# EAGLE design GBZLNDShield (EAGLE 9.1.0)
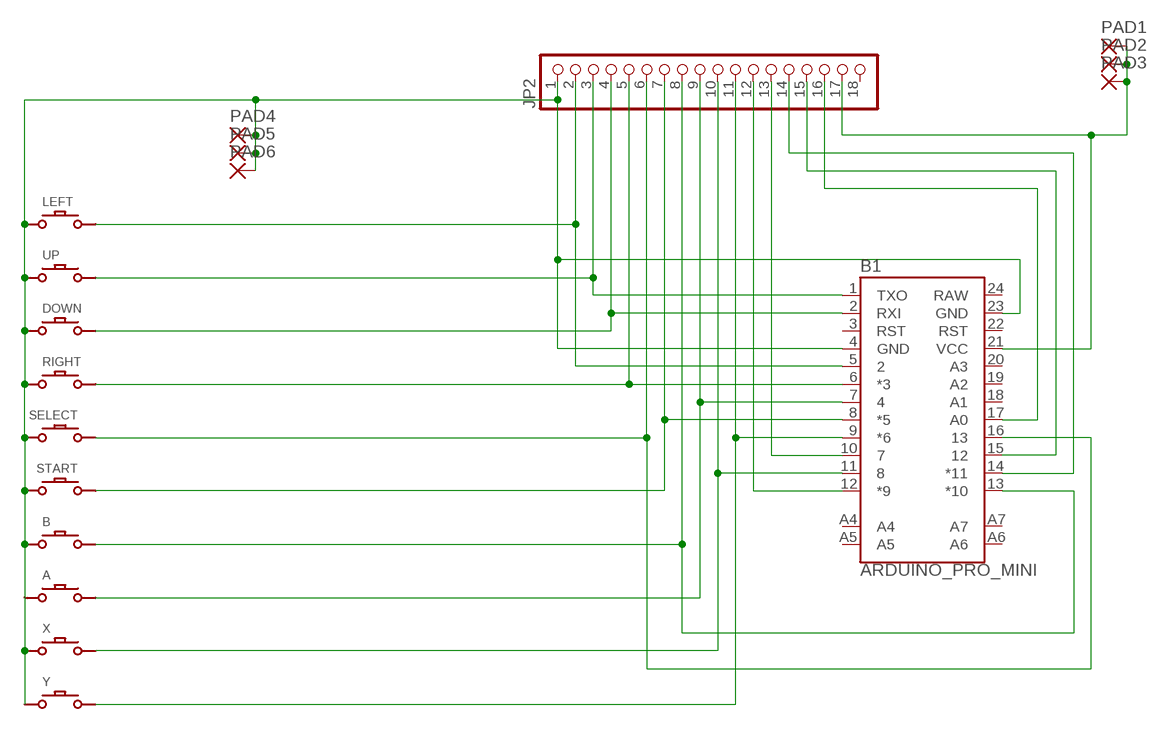
[diagram p0: schematic, sheet 1]

## Parts
A  DMG-BTN  DMG-BTNREGULAR  [DMG-BTN]
B  DMG-BTN  DMG-BTNREGULAR  [DMG-BTN]
B1  ARDUINO_PRO_MINI  [ARDUINO_PRO_MINI]
DOWN  DMG-BTN  DMG-BTNREGULAR  [DMG-BTN]
JP2  PINHD-1X18-BIG  [1X18-BIG]
LEFT  DMG-BTN  DMG-BTNREGULAR  [DMG-BTN]
PAD1  SMD5  [SMD2,54-5,08]
PAD2  SMD5  [SMD2,54-5,08]
PAD3  SMD5  [SMD2,54-5,08]
PAD4  SMD5  [SMD2,54-5,08]
PAD5  SMD5  [SMD2,54-5,08]
PAD6  SMD5  [SMD2,54-5,08]
RIGHT  DMG-BTN  DMG-BTNREGULAR  [DMG-BTN]
SELECT  DMG-BTN  DMG-BTNSELECT  [DMG-SEL]
START  DMG-BTN  DMG-BTNSELECT  [DMG-SEL]
UP  DMG-BTN  DMG-BTNREGULAR  [DMG-BTN]
X  DMG-BTN  DMG-BTNREGULAR  [DMG-BTN]
Y  DMG-BTN  DMG-BTNREGULAR  [DMG-BTN]

## Nets
GND: A.P$1 B1.4(GND) B1.23(GND) B.P$1 DOWN.P$1 JP2.1 LEFT.P$1 PAD4.1(P) PAD5.1(P) PAD6.1(P) RIGHT.P$1 SELECT.P$2 START.P$2 UP.P$1 X.P$1 Y.P$1
N$1: B1.5 JP2.2 LEFT.P$2
N$2: B1.1(TXO) JP2.3 UP.P$2
N$3: B1.2(RXI) DOWN.P$2 JP2.4
N$4: B1.6(*3) JP2.5 RIGHT.P$2
N$5: B1.16 JP2.6 SELECT.P$1
N$6: B1.12(*9) JP2.12
N$7: B1.13(*10) B.P$2 JP2.8
N$8: A.P$2 B1.7 JP2.9
N$9: B1.10 JP2.13
N$10: B1.14(*11) JP2.14
N$11: B1.8(*5) JP2.7 START.P$1
N$12: B1.9(*6) JP2.11 Y.P$2
N$13: B1.11 JP2.10 X.P$2
N$14: B1.15 JP2.15
N$15: B1.17(A0) JP2.16
N$17: B1.21(VCC) JP2.17 PAD1.1(P) PAD2.1(P) PAD3.1(P)
Unconnected: B1.3(RST) B1.18(A1) B1.19(A2) B1.20(A3) B1.22(RST) B1.A4 B1.A5 B1.A6 B1.A7 JP2.18

## Power pins joined to a net without a drawn wire
RAW: B1.24(RAW)

## Library data of the parts
A B DOWN LEFT RIGHT SELECT START UP X Y = Game Boy:DMG-BTN
B1 = SparkFun-Boards:ARDUINO_PRO_MINI: SparkFun Pro Mini Pro Mini compatible footprint. Dimensions: 0.7 x 1.3" PCB Thickness: 0.8mm SparkFun Products: 3.3V/8MHz <https://www.sparkfun.com/products/11114> 5V/16MHz <https://www.sparkfun.com/products/11113>
JP2 = adafruit:PINHD-1X18: PIN HEADER
PAD1-PAD6 = wirepad:SMD5: SMD PAD

## Board
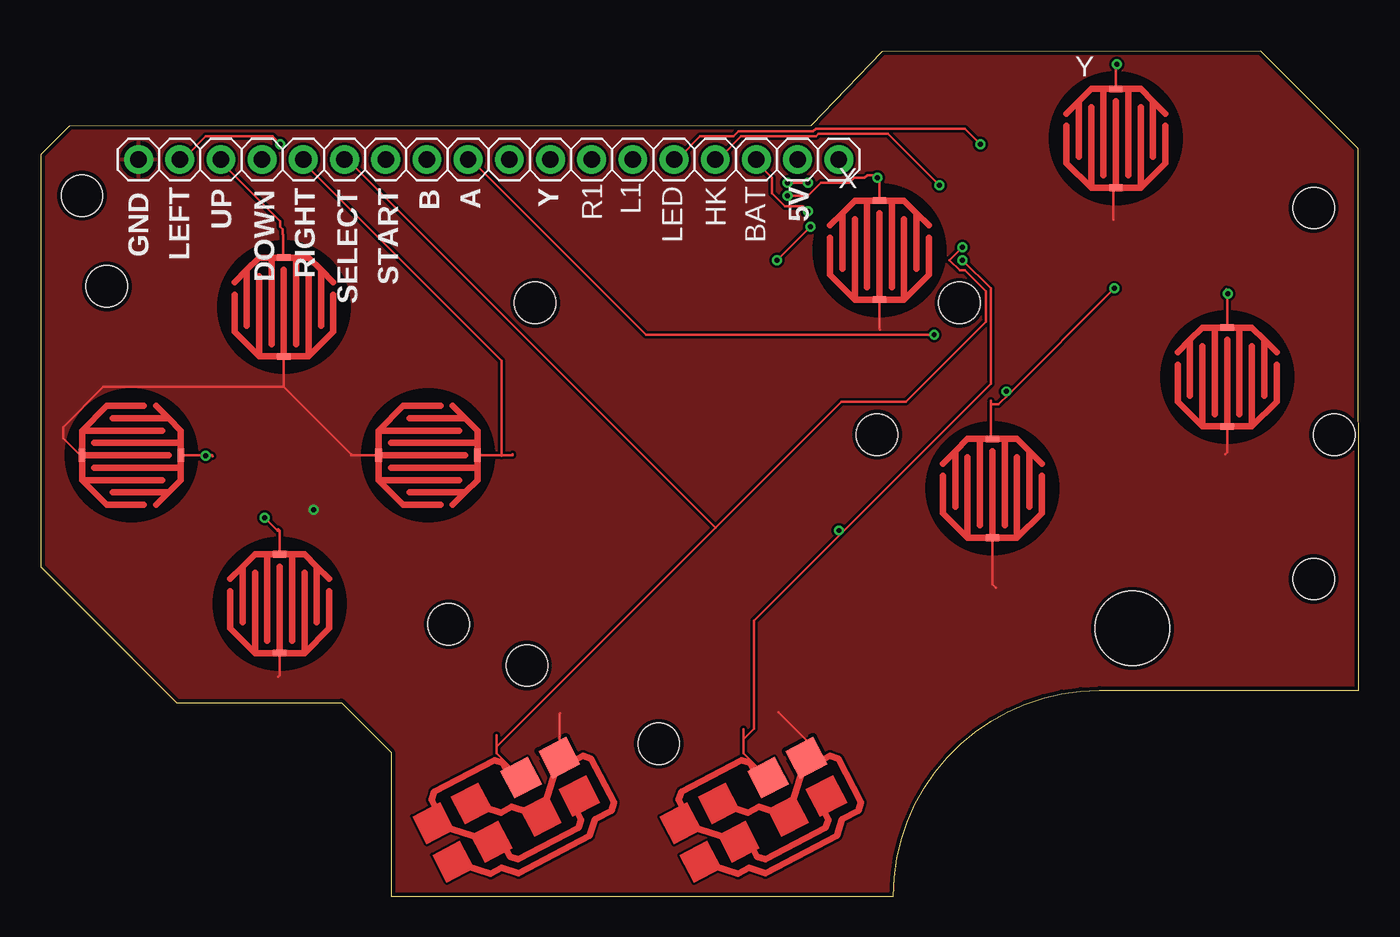
[diagram p1: board, top side]
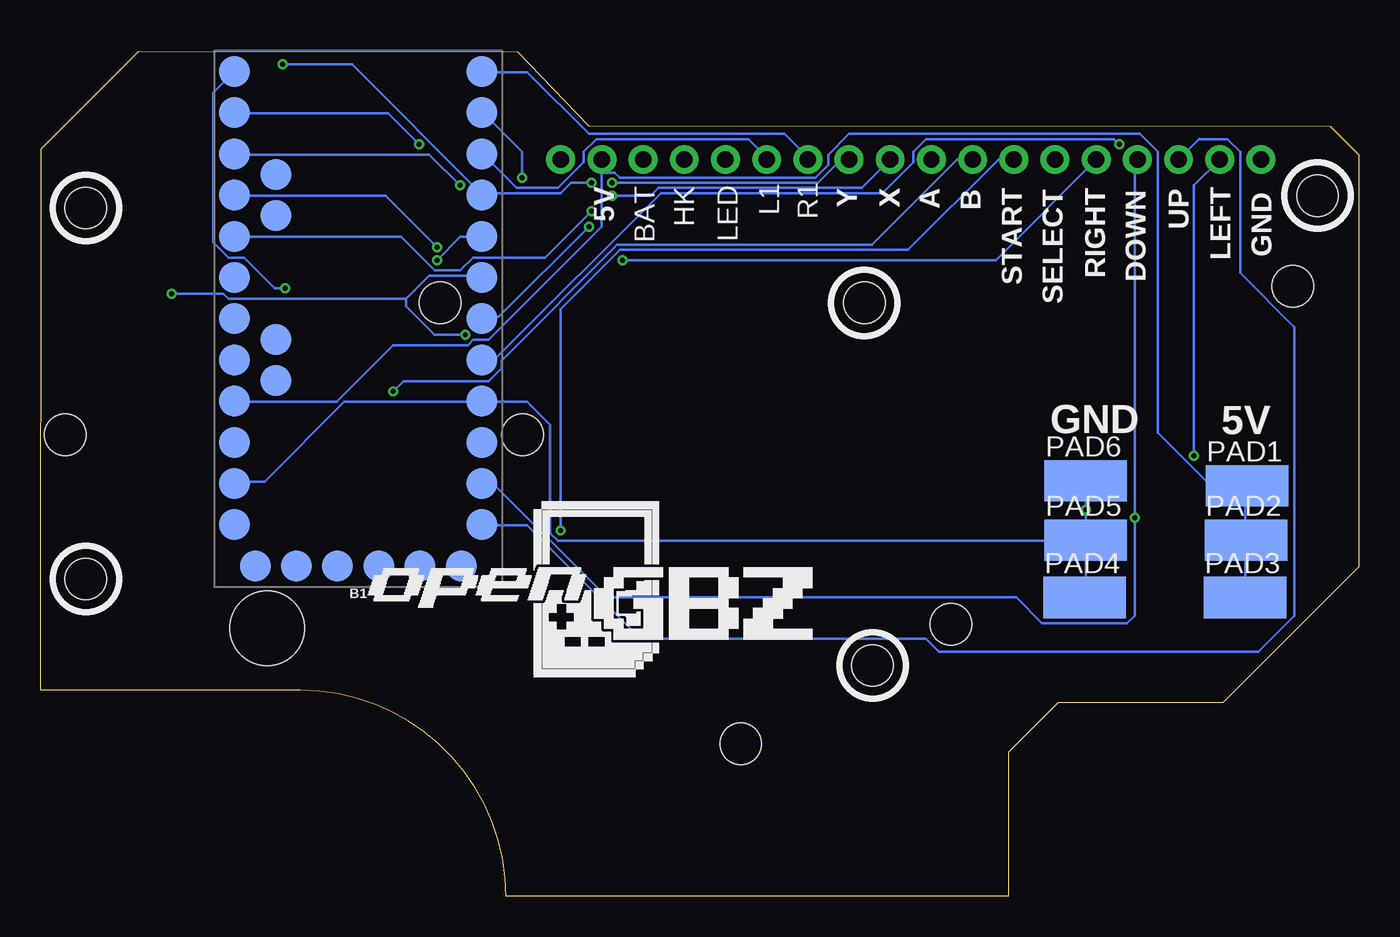
[diagram p2: board, bottom side, seen from below]

Size 81.3 x 52.08 mm. Coordinates in mm from the lower left corner, seen from the top.
Outline: 75.24,52.08 51.89,52.07 47.52,47.5 1.78,47.48 0,45.7 0.02,20.32 8.4,11.94 18.56,11.94 21.61,8.89 21.61,0 52.6,0 arc-90 65.3,12.7 81.3,12.7 81.26,45.73 81.26,45.75 81.26,46.01 81.26,46.01 81.26,46.06 81.25,46.08 81.25,46.08 75.24,52.08
Copper layers (1*16): Top 0.035mm / dielectric 1.5mm / Bottom 0.035mm
Design rules "ITEADstudio_DRC": minimum track width 6mil, minimum drill 12mil, track to track 6mil, track to pad 6mil, pad to pad 6mil, via to via 6mil, smd to smd 0mil, copper to edge 10mil, drill to drill 10mil, minimum pad ring 10mil, minimum via ring 6mil, stop-mask expansion 2mil, vias tented up to drill 100mil, thermal gap 10mil
Holes 4.57 mm at 67.33,16.51
Holes 2.54 mm at 2.56,43.18 78.5,42.42 78.5,19.56 30.5,36.58 56.66,36.58 29.99,14.22 51.58,28.45 25.16,16.76 38.12,9.4 79.77,28.45 4.08,37.59

### Footprints (pad centres in the part's own frame; a part is rotated, then mirrored left to right if it is on the bottom)
DMG-BTN = smd 0.813 x 0.406: P$1 0,-3.048; P$2 0,3.048
ARDUINO_PRO_MINI = smd 1.905 x 1.905: 1 -7.62,12.7; 2 -7.62,10.16; 3 -7.62,7.62; 4 -7.62,5.08; 5 -7.62,2.54; 6 -7.62,0; 7 -7.62,-2.54; 8 -7.62,-5.08; 9 -7.62,-7.62; 10 -7.62,-10.16; 11 -7.62,-12.7; 12 -7.62,-15.24; 13 7.62,-15.24; 14 7.62,-12.7; 15 7.62,-10.16; 16 7.62,-7.62; 17 7.62,-5.08; 18 7.62,-2.54; 19 7.62,0; 20 7.62,2.54; 21 7.62,5.08; 22 7.62,7.62; 23 7.62,10.16; 24 7.62,12.7; A4 5.08,1.27; A5 5.08,3.81; A6 5.08,-8.89; A7 5.08,-6.35; BLK -6.35,15.24; GND -3.81,15.24; GRN 6.35,15.24; RXI 1.27,15.24; TX0 3.81,15.24; VCC -1.27,15.24
1X18-BIG = drill 1.016 pad 1.778: 1 -21.59,0; 2 -19.05,0; 3 -16.51,0; 4 -13.97,0; 5 -11.43,0; 6 -8.89,0; 7 -6.35,0; 8 -3.81,0; 9 -1.27,0; 10 1.27,0; 11 3.81,0; 12 6.35,0; 13 8.89,0; 14 11.43,0; 15 13.97,0; 16 16.51,0; 17 19.05,0; 18 21.59,0
SMD2,54-5,08 = smd 2.54 x 5.08: 1 0,0
DMG-SEL = smd 1.905 x 1.905: P$1 1.714,1.333; P$2 4.381,1.333

### Placement (x,y rotation side)
A  73.17,32 0 top
B  58.69,25.15 0 top
B1  61.71,35.6 180 bottom
DOWN  14.75,18.03 0 top
JP2  27.63,45.42 0 top
LEFT  5.61,27.18 270 top
PAD1  6.91,25.3 270 bottom
PAD2  6.97,21.95 270 bottom
PAD3  7.03,18.41 270 bottom
PAD4  16.9,18.41 270 bottom
PAD5  16.84,21.95 270 bottom
PAD6  16.84,25.6 270 bottom
RIGHT  23.89,27.18 270 top
SELECT  28.72,5.33 27.5 top
START  43.96,5.33 27.5 top
UP  15,36.32 0 top
X  51.73,39.83 0 top
Y  66.31,46.72 0 top

### Tracks (layer width: path | path; a pad name or v marks a point on that pad's centre or on a via)
GND  (via drill 0.3)
  Top 0.152: RIGHT.P$1 19.22,27.18 | 19.22,27.18 19.16,27.18 19.16,27.25 | UP.P$1 15,31.39 | 15,31.39 19.22,27.18 | 15,31.39 3.88,31.39 1.4,28.92 1.4,28.22 2.45,27.18 LEFT.P$1 | DOWN.P$1 14.75,13.63 14.65,13.53 | SELECT.P$2 31.99,11.25 32.02,11.28 | START.P$2 47.23,9.6 45.49,11.34 | B.P$1 58.69,19.23 58.91,19.02 | A.P$1 73.17,27.37 73.05,27.25 | X.P$1 51.73,34.98 51.77,34.93 | Y.P$1 66.16,43.52 66.16,41.7
  Bottom 0.152: PAD6.1 16.85,25.56 v16.85,23.81 16.85,22.07 PAD5.1 16.85,21.91 | 16.85,21.91 16.85,18.41 PAD4.1 | B1.23 69.23,25.56 67.49,25.56 62.57,30.48 54.15,30.48 B1.4 53.99,30.48 51.29,30.48 49.87,29.05 49.87,22.38 49.39,21.91 16.85,21.91
  pour Top (rank 6): 0.04,45.75 1.78,47.48 1.8,47.48 47.35,47.48 51.91,52.04 75.32,52.04 75.5,51.86 81.27,46.09 81.27,45.56 81.27,12.75 81.22,12.69 65.05,12.69 65.05,12.69 arc90 52.55,0.2 52.55,0.03 21.6,0.03 21.6,0.03 21.6,8.84 18.5,11.94 8.35,11.94 0.04,20.25
N$1  (via drill 0.3)
  Top 0.152: LEFT.P$2 10.18,27.18 | 10.18,27.18 10.57,27.18 10.63,27.13 | v10.18,27.15 10.18,27.18 | v14.78,46.35 14.31,46.83 10.18,46.83 8.91,45.56 8.59,45.56 JP2.2
  Bottom 0.152: v10.18,27.15 10.18,43.81 8.59,45.4 JP2.2 | v14.78,46.35 15.1,46.67 26.69,46.67 27.48,45.88 27.48,45.24 29.39,43.34 43.04,43.34 53.2,33.18 53.99,33.18 B1.5
N$2
  Top 0.152: UP.P$2 14.95,39.42 14.95,40.78 14.94,40.8 14.94,41.12 14.78,41.27 14.78,41.59 10.97,45.4 JP2.3
  Bottom 0.152: B1.1 53.99,22.86 51.29,22.86 44.31,15.88 26.69,15.88 25.89,15.08 6.21,15.08 3.99,17.3 3.99,35.08 7.32,38.42 7.32,45.88 8.11,46.67 9.86,46.67 10.97,45.56 JP2.3
N$3  (via drill 0.3)
  Top 0.152: DOWN.P$2 14.75,22.52 14.67,22.59 | 14.67,22.59 14.65,22.62 | v13.83,23.34 14.62,22.54 14.67,22.59
  Bottom 0.152: JP2.4 13.67,45.4 13.83,45.24 v13.83,23.34 13.83,17.3 14.31,16.83 19.54,16.83 21.13,18.41 46.37,18.41 53.36,25.4 53.99,25.4 B1.2
N$4  (via drill 0.3)
  Top 0.152: RIGHT.P$2 28.43,27.18 | 28.43,27.18 29.1,27.18 29.1,27.25 | 28.43,27.18 28.43,33.02 16.05,45.4 JP2.5 | 28.43,27.15 28.43,27.18 | v45.42,39.21 v47.48,41.27
  Bottom 0.152: v47.48,41.27 53.04,35.72 53.99,35.72 B1.6 | v45.42,39.21 22.4,39.21 16.21,45.4 JP2.5
N$5  (via drill 0.3)
  Top 0.152: SELECT.P$1 28.12,8.81 28.12,9.21 | 28.12,9.21 28.12,9.94 | v56.85,40.01 56.06,39.21 56.69,38.58 57.01,38.58 58.28,37.31 58.28,35.4 53.36,30.48 49.39,30.48 41.61,22.7 | 41.61,22.7 28.12,9.21 | 41.61,22.7 19.39,44.93 19.23,44.93 18.75,45.4 JP2.6
  Bottom 0.152: v56.85,40.01 60.03,43.18 69.23,43.18 B1.16
N$6
  Bottom 0.152: B1.12 53.99,50.8 51.29,50.8 47.48,46.99 35.42,46.99 33.99,45.56 JP2.12
N$7  (via drill 0.3)
  Top 0.152: B.P$2 58.6,28.29 58.6,30.32 | 58.6,30.32 58.6,30.54 | 58.6,30.32 59.07,30.32 59.71,30.96 | v66.22,37.47 59.71,30.96 | 58.6,30.32 | 59.71,30.96 v59.55,31.11
  Bottom 0.152: v66.22,37.47 66.85,37.47 68.76,39.37 69.71,39.37 70.66,40.32 70.66,49.53 69.39,50.8 B1.13 | v59.55,31.11 58.91,31.75 53.68,31.75 52.88,32.54 52.88,33.02 45.74,40.16 30.02,40.16 24.78,45.4 23.83,45.4 JP2.8
N$8  (via drill 0.3)
  Top 0.152: A.P$2 73.17,37.15 | 73.17,37.15 73.17,37.37 73.11,37.43 | v73.2,37.15 73.17,37.15 | v55.1,34.61 37.32,34.61 27.01,44.93 26.85,44.93 26.37,45.4 JP2.9
  Bottom 0.152: v73.2,37.15 70.03,37.15 69.71,36.83 58.76,36.83 | 58.76,36.83 57.33,38.26 54.15,38.26 B1.7 | v55.1,34.61 57.01,34.61 58.76,36.35 58.76,36.83
N$9
  Bottom 0.152: B1.10 53.99,45.72 51.93,43.66 49.39,43.66 47.8,45.24 47.8,45.88 47.01,46.67 37.64,46.67 36.53,45.56 JP2.13
N$10  (via drill 0.3)
  Top 0.152: v57.96,46.35 57.01,47.31 47.8,47.31 47.64,47.15 43.04,47.15 42.72,46.83 40.66,46.83 39.39,45.56 39.07,45.56 JP2.14
  Bottom 0.152: v57.96,46.35 59.87,48.26 69.23,48.26 B1.14
N$11  (via drill 0.3)
  Top 0.152: START.P$1 43.36,8.81 43.36,9.68 | 43.36,9.68 43.36,10.3 | v56.85,39.21 58.6,37.47 58.6,31.59 49.39,22.38 | 49.39,22.38 43.99,16.99 43.99,10.32 43.36,9.68 | 49.39,22.38 v49.23,22.54
  Bottom 0.152: v56.85,39.21 55.42,40.64 54.15,40.64 B1.8 | v49.23,22.54 49.23,36.2 45.58,39.85 27.8,39.85 22.24,45.4 21.29,45.4 JP2.7
N$12  (via drill 0.3)
  Top 0.152: Y.P$2 66.31,51.17 66.34,51.21 v66.38,51.28 | v47.33,43.97 v46.06,43.97
  Bottom 0.152: v66.38,51.28 62.09,51.28 54.15,43.34 B1.9 53.99,43.34 49.23,43.34 48.6,43.97 v47.33,43.97 | v46.06,43.97 33.36,43.97 31.93,45.4 31.45,45.4 JP2.11
N$13  (via drill 0.3)
  Top 0.152: X.P$2 51.73,44.06 51.63,44.15 | 51.63,44.15 51.53,44.26 | 51.63,44.15 51.61,44.13 v51.61,44.29 51.45,44.45 50.98,44.45 50.82,44.29 50.18,44.29 49.87,43.97 48.12,43.97 47.33,43.18 v46.06,43.18
  Bottom 0.152: v51.61,44.29 51.61,45.88 53.99,48.26 B1.11 | v46.06,43.18 43.67,43.18 43.2,43.66 30.66,43.66 28.91,45.4 JP2.10
N$14  (via drill 0.3)
  Top 0.152: v55.42,43.81 52.25,46.99 47.96,46.99 47.8,46.83 43.2,46.83 41.93,45.56 41.61,45.56 JP2.15
  Bottom 0.152: v55.42,43.81 57.33,45.72 69.23,45.72 B1.15
N$15  (via drill 0.3)
  Top 0.152: v47.33,42.23 47.01,42.55 45.9,42.55 45.1,43.34 45.1,44.29 43.99,45.4 JP2.16
  Bottom 0.152: v47.33,42.23 50.18,39.37 54.63,39.37 55.42,38.58 57.01,38.58 59.07,40.64 69.23,40.64 B1.17
N$17
  Bottom 0.152: PAD3.1 7,18.41 7,21.91 PAD2.1 7,22.07 7,25.24 PAD1.1 7,25.4 9.23,25.4 12.4,28.57 12.4,45.88 13.51,46.99 31.45,46.99 32.72,45.72 32.72,45.09 33.51,44.29 45.58,44.29 45.9,44.61 46.69,44.61 | 46.69,44.61 46.69,45.4 JP2.17 46.69,44.61 | 46.69,44.61 46.69,41.27 53.68,34.29 54.63,34.29 54.95,33.97 59.55,33.97 63.04,30.48 69.23,30.48 B1.21

### Text on the board
tNames: LEFT | UP | DOWN | RIGHT | SELECT | START | B | A | Y | R1 | L1 | LED | HK | BAT | 5V | GND
bNames: LEFT | UP | DOWN | RIGHT | SELECT | START | B | A | X | X | Y | R1 | L1 | LED | HK | BAT | 5V | GND | GND | 5V